# Altium schematic sheet connect.SchDoc
size A4
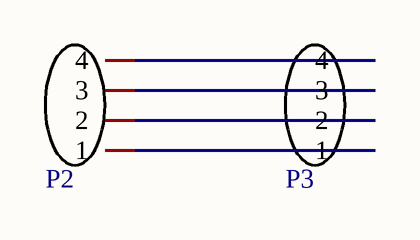
[diagram p0: connect.SchDoc]

## Parts
P2  HDR1x4_1.27  [FPC-SMD_4P-P0.50_DEALON_0.5K-DX-4PWB]  (value not drawn)
P3  HDR1x4_1.27  [HDR1X4_1.27_180]  (value not drawn)

## Nets
NetP2_1: P2.1 P3.1
NetP2_2: P2.2 P3.2
NetP2_3: P2.3 P3.3
NetP2_4: P2.4 P3.4

## Library data of the parts
P2 = HDR1x4_1.27: Header; Origin Footprint 2: HDR1X4_1.27_180F; Origin Footprint 3: HDR1X4_1.27_180H; Origin Footprint 4: HDR1X4_1.27_180HF; Add into BOM: yes; Origin Footprint 1: HDR1X4_1.27_180; Name: HDR1x4_1.27; Symbol: HDR1x4_1.27; Device: HDR1x4_1.27; Convert to PCB: yes
P3 = HDR1x4_1.27: Header; Origin Footprint 2: HDR1X4_1.27_180F; Origin Footprint 3: HDR1X4_1.27_180H; Origin Footprint 4: HDR1X4_1.27_180HF; Add into BOM: yes; Name: HDR1x4_1.27; Symbol: HDR1x4_1.27; Device: HDR1x4_1.27; Convert to PCB: yes; Origin Footprint 1: HDR1X4_1.27_180